# EAGLE design smartThermometer (EAGLE 7.2.0)
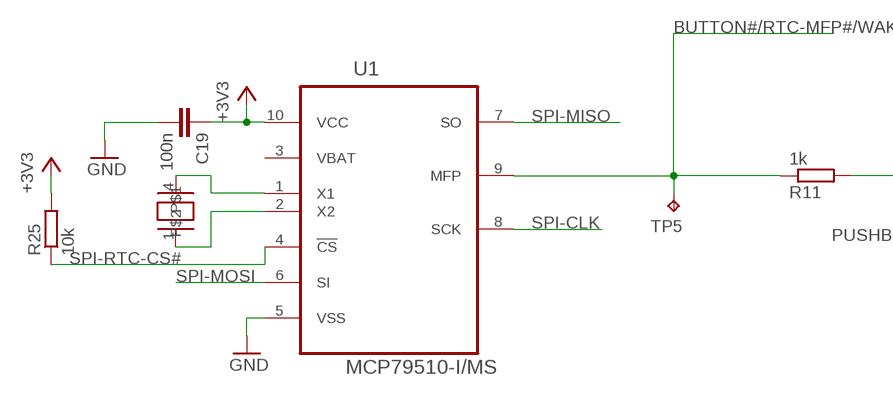
[diagram p0: schematic, sheet 1, part 1 of 2]
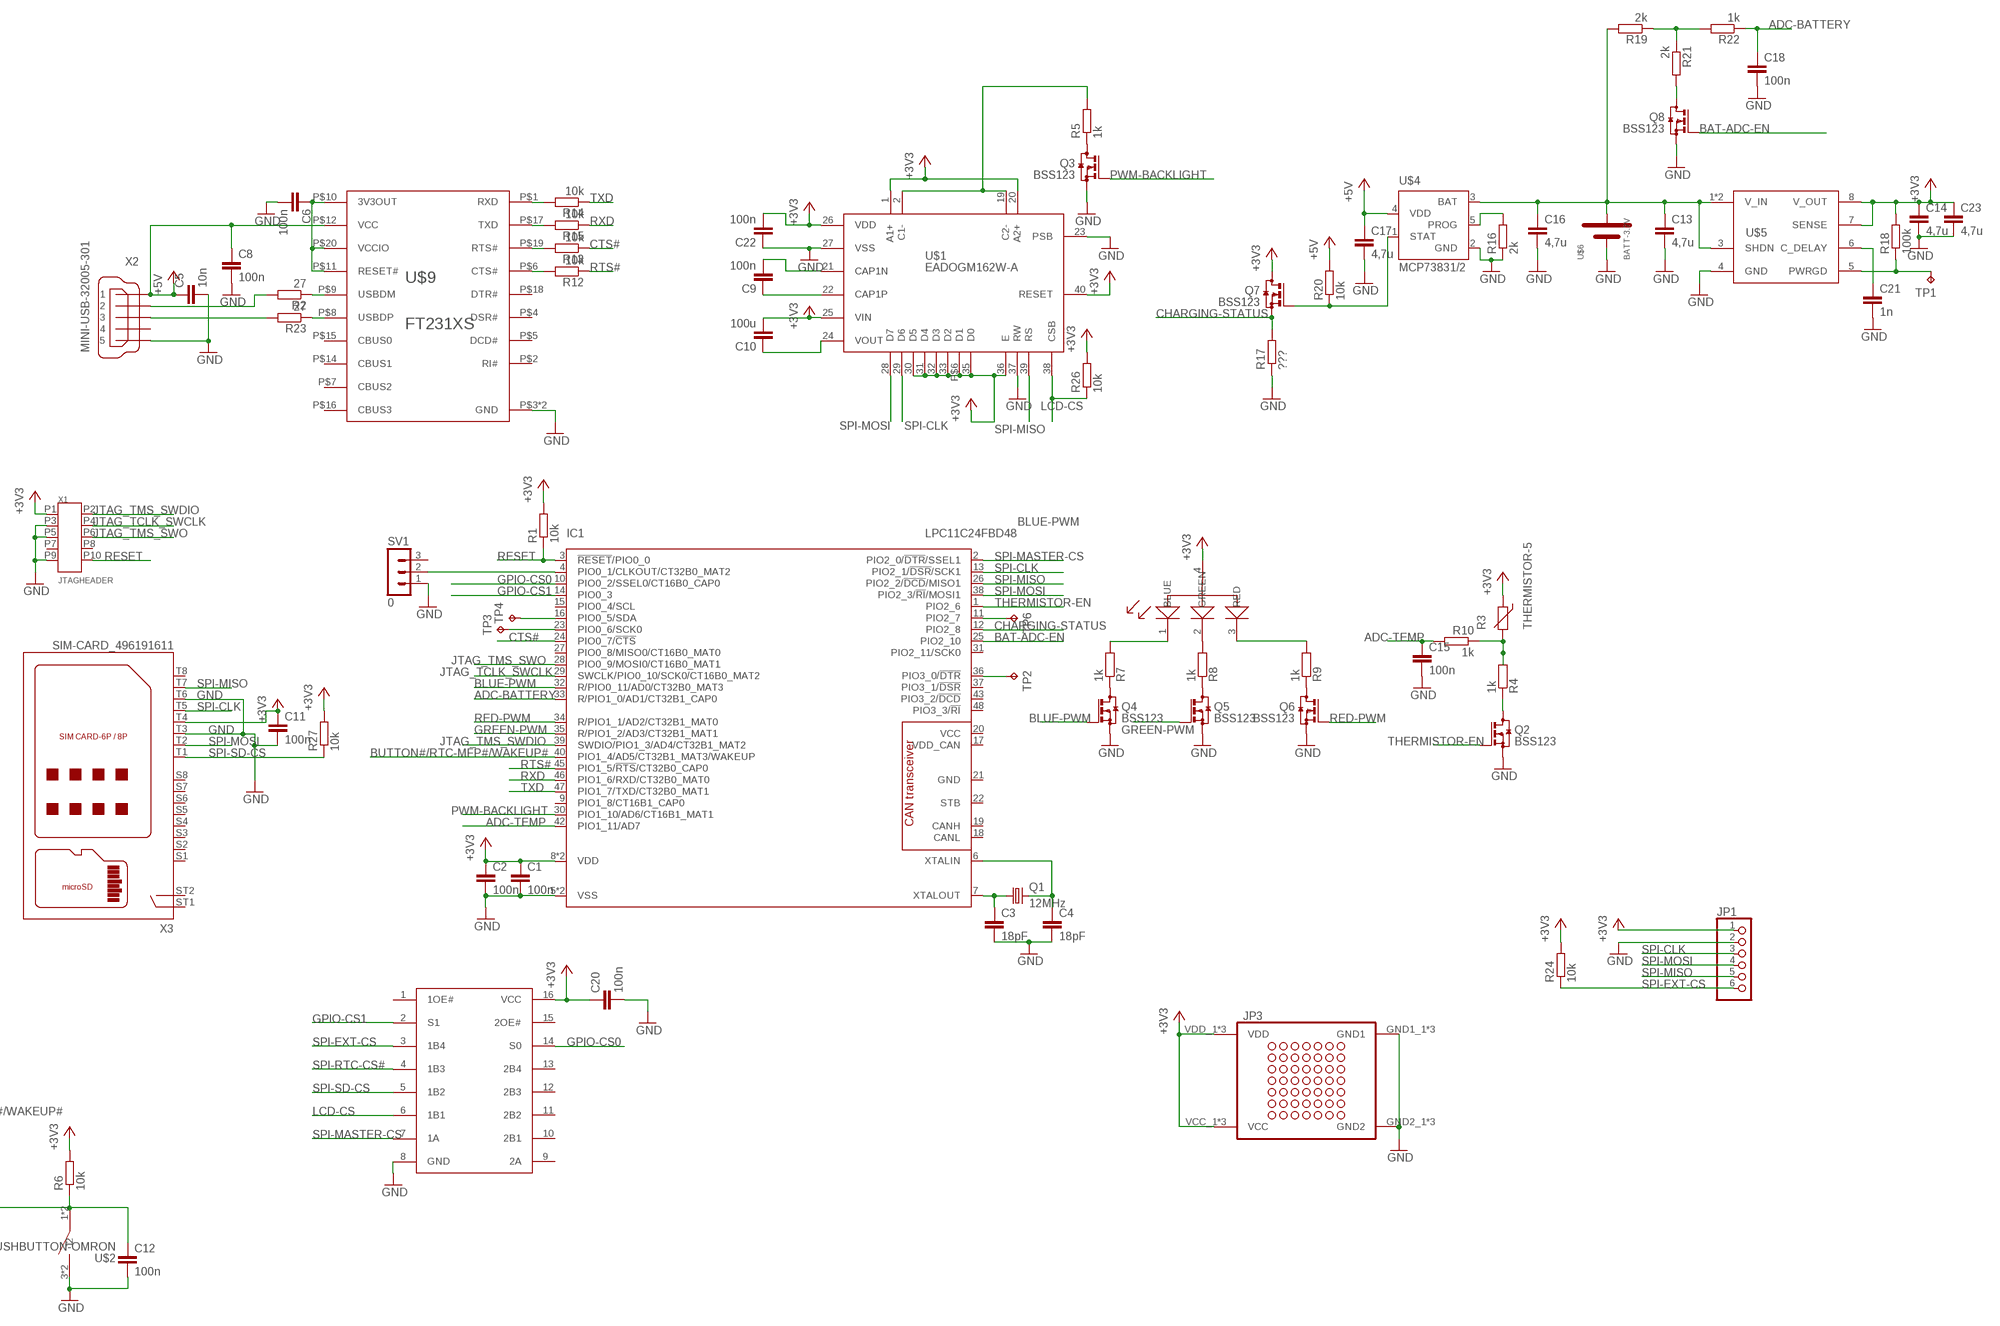
[diagram p1: schematic, sheet 1, part 2 of 2]

## Parts
C1  100n  C-EUC0603  [C0603]
C2  100n  C-EUC0603  [C0603]
C3  18pF  C-EUC0603  [C0603]
C4  18pF  C-EUC0603  [C0603]
C5  10n  C-EUC0603  [C0603]
C6  100n  C-EUC0603  [C0603]
C8  100n  C-EUC0603  [C0603]
C9  100n  C-EUC0603  [C0603]
C10  100u  C-EUC0603  [C0603]
C11  100n  C-EUC0603  [C0603]
C12  100n  C-EUC0603  [C0603]
C13  4,7u  C-EUC0805  [C0805]
C14  4,7u  C-EUC0805  [C0805]
C15  100n  C-EUC0603  [C0603]
C16  4,7u  C-EUC0805  [C0805]
C17  4,7u  C-EUC0805  [C0805]
C18  100n  C-EUC0603  [C0603]
C19  100n  C-EUC0603  [C0603]
C20  100n  C-EUC0603  [C0603]
C21  1n  C-EUC0603  [C0603]
C22  100n  C-EUC0603  [C0603]
C23  4,7u  C-EUC0805  [C0805]
IC1  LPC11C24FBD48  [SOT313-2]
JP1  PINHD-1X6  [1X06]
JP3  PROTOTYPE_2U_SMALL  [PROTOTYPE8X6]
Q1  12MHz  CRYSTALHC49UP  [HC49UP]
Q2  BSS123  [SOT23]
Q3  BSS123  [SOT23]
Q4  BSS123  [SOT23]
Q5  BSS123  [SOT23]
Q6  BSS123  [SOT23]
Q7  BSS123  [SOT23]
Q8  BSS123  [SOT23]
R1  10k  R-EU_R0603  [R0603]
R2  27  R-EU_R0603  [R0603]
R3  THERMISTOR-5  [R-5]
R4  1k  R-EU_R0603  [R0603]
R5  1k  R-EU_R0603  [R0603]
R6  10k  R-EU_R0603  [R0603]
R7  1k  R-EU_R0603  [R0603]
R8  1k  R-EU_R0603  [R0603]
R9  1k  R-EU_R0603  [R0603]
R10  1k  R-EU_R0603  [R0603]
R11  1k  R-EU_R0603  [R0603]
R12  10k  R-EU_R0603  [R0603]
R13  10k  R-EU_R0603  [R0603]
R14  10k  R-EU_R0603  [R0603]
R15  10k  R-EU_R0603  [R0603]
R16  2k  R-EU_R0603  [R0603]
R17  ???  R-EU_R0603  [R0603]
R18  100k  R-EU_R0603  [R0603]
R19  2k  R-EU_R0603  [R0603]
R20  10k  R-EU_R0603  [R0603]
R21  2k  R-EU_R0603  [R0603]
R22  1k  R-EU_R0603  [R0603]
R23  27  R-EU_R0603  [R0603]
R24  10k  R-EU_R0603  [R0603]
R25  10k  R-EU_R0603  [R0603]
R26  10k  R-EU_R0603  [R0603]
R27  10k  R-EU_R0603  [R0603]
SV1  0  MA03-1  [MA03-1]
TP1  TPTP18SQ  [TP18SQ]
TP2  TPTP16SQ  [TP16SQ]
TP3  TPTP16SQ  [TP16SQ]
TP4  TPTP16SQ  [TP16SQ]
TP5  TPTP16SQ  [TP16SQ]
TP6  TPTP16SQ  [TP16SQ]
U1  MCP79510-I/MS  [SOP50P490X110-10N]
U$1  EADOGM162W-A  [LCD_FOOTPRINT]
U$2  PUSHBUTTON-OMRON  [PUSHBUTTON-OMRON-B3FS-4002P]
U$3  LED-RGB-EVERLIGHT  [LED-RGB-EVERLIGHT]
U$4  MCP73831/2  [SOT23-5L]
U$5  MCP1725  [SO08]
U$6  BATT-3.7V  [MA02-1+-]
U$7  CRYSTAL-32.768KHZ-GEYER  [32.768KHZ]
U$8  DEMUX-1-4-NXP  [TSSOP16]
U$9  FT231XS  [SSOP20]
X1  JTAGHEADER  [HEADER10]
X2  MINI-USB-32005-301  [32005-301]
X3  SIM-CARD_496191611  [SIM-CARD_496191611]

## Nets
+3V3: C1.1 C2.1 C10.2 C11.1 C14.1 C19.1 C20.1 C22.2 C23.1 IC1.8(VDD) IC1.44(VDD) JP1.1 JP3.VCC_1(VCC) JP3.VCC_2(VCC) JP3.VCC_3(VCC) JP3.VDD_1(VDD) JP3.VDD_2(VDD) JP3.VDD_3(VDD) Q7.3(D) R1.2 R3.1 R6.2 R18.2 R24.2 R25.2 R26.2 R27.2 U1.10(VCC) U$1.1(A1+) U$1.20(A2+) U$1.25(VIN) U$1.26(VDD) U$1.30(D5) U$1.31(D4) U$1.32(D3) U$1.33(D2) U$1.35(D0) U$1.36(E) U$1.40(RESET) U$1.P$6(D1) U$3.4(COMMON_ANODE) U$5.7(SENSE) U$5.8(V_OUT) U$8.16(VCC) X1.P1 X3.T4
+5V: C5.1 C8.1 C17.1 R20.2 U$4.4(VDD) U$9.P$12(VCC) X2.1
ADC: R3.2 R4.2 R10.1
ADC-BATTERY: C18.1 IC1.33(R/PIO1_0/AD1/CT32B1_CAP0) R22.1
ADC-TEMP: C15.1 IC1.42(PIO1_11/AD7) R10.2
BAT-ADC-EN: IC1.25(PIO2_10) Q8.1(G)
BLUE-PWM: IC1.32(R/PIO0_11/AD0/CT32B0_MAT3) Q4.1(G)
BUTTON#/RTC-MFP#/WAKEUP#: IC1.40(PIO1_4/AD5/CT32B1_MAT3/WAKEUP) R11.1 TP5.TP U1.9(MFP)
CHARGING-STATUS: IC1.12(PIO2_8) Q7.2(S) R17.2
CTS#: IC1.24(PIO0_7/!CTS!) R13.1
GND: C1.2 C2.2 C3.2 C4.2 C5.2 C6.2 C8.2 C11.2 C12.2 C13.2 C14.2 C15.2 C16.2 C17.2 C18.2 C19.2 C20.2 C21.2 C22.1 C23.2 IC1.5(VSS) IC1.41(VSS) JP1.2 JP3.GND1_1(GND1) JP3.GND1_2(GND1) JP3.GND1_3(GND1) JP3.GND2_1(GND2) JP3.GND2_2(GND2) JP3.GND2_3(GND2) Q2.2(S) Q3.2(S) Q4.2(S) Q5.2(S) Q6.2(S) Q8.2(S) R16.1 R17.1 SV1.1 U1.5(VSS) U$1.23(PSB) U$1.27(VSS) U$1.37(RW) U$2.3 U$2.4 U$4.2(GND) U$5.4(GND) U$6.2(BAT-) U$8.8(GND) U$9.P$3(GND) U$9.P$13(GND) X1.P3 X1.P5 X1.P9 X2.5 X3.T3 X3.T6
GPIO-CS0: IC1.10(PIO0_2/SSEL0/CT16B0_CAP0) U$8.14(S0)
GPIO-CS1: IC1.14(PIO0_3) U$8.2(S1)
GREEN-PWM: IC1.35(R/PIO1_2/AD3/CT32B1_MAT1) Q5.1(G)
JTAG_TCLK_SWCLK: IC1.29(SWCLK/PIO0_10/SCK0/CT16B0_MAT2) X1.P4
JTAG_TMS_SWDIO: IC1.39(SWDIO/PIO1_3/AD4/CT32B1_MAT2) X1.P2
JTAG_TMS_SWO: IC1.28(PIO0_9/MOSI0/CT16B0_MAT1) X1.P6
LCD-CS: R26.1 U$1.38(CSB) U$8.6(1B1)
N$1: R2.2 X2.2
N$2: R23.2 X2.3
N$3: C3.1 IC1.7(XTALOUT) Q1.1
N$4: C4.1 IC1.6(XTALIN) Q1.2
N$5: C9.2 U$1.21(CAP1N)
N$6: C6.1 U$9.P$10(3V3OUT) U$9.P$11(RESET#) U$9.P$20(VCCIO)
N$7: C9.1 U$1.22(CAP1P)
N$8: C10.1 U$1.24(VOUT)
N$9: Q2.3(D) R4.1
N$10: R5.2 U$1.2(C1-) U$1.19(C2-)
N$11: Q3.3(D) R5.1
N$12: R2.1 U$9.P$9(USBDM)
N$13: R8.2 U$3.2(GREEN)
N$14: R7.2 U$3.1(BLUE)
N$15: R9.2 U$3.3(RED)
N$16: Q4.3(D) R7.1
N$17: Q5.3(D) R8.1
N$18: Q6.3(D) R9.1
N$19: IC1.4(PIO0_1/CLKOUT/CT32B0_MAT2) SV1.2
N$20: C13.1 C16.1 R19.2 U$4.3(BAT) U$5.1(V_IN) U$5.2(V_IN) U$5.3(SHDN) U$6.1(BAT+)
N$21: R16.2 U$4.5(PROG)
N$22: R19.1 R21.1 R22.2
N$23: Q7.1(G) R20.1 U$4.1(STAT)
N$24: R14.2 U$9.P$1(RXD)
N$25: R15.2 U$9.P$17(TXD)
N$26: C21.1 U$5.6(C_DELAY)
N$27: R18.1 TP1.TP U$5.5(PWRGD)
N$28: R13.2 U$9.P$19(RTS#)
N$29: R12.2 U$9.P$6(CTS#)
N$30: U1.1(X1) U$7.4
N$31: U1.2(X2) U$7.1
N$32: Q8.3(D) R21.2
N$33: R23.1 U$9.P$8(USBDP)
N$34: IC1.36(PIO3_0/!DTR!) TP2.TP
N$35: IC1.23(PIO0_6/SCK0) TP3.TP
N$36: IC1.16(PIO0_5/SDA) TP4.TP
N$37: IC1.11(PIO2_7) TP6.TP
N$38: C12.1 R6.1 R11.2 U$2.1 U$2.2
PWM-BACKLIGHT: IC1.30(PIO1_10/AD6/CT16B1_MAT1) Q3.1(G)
RED-PWM: IC1.34(R/PIO1_1/AD2/CT32B1_MAT0) Q6.1(G)
RESET: IC1.3(!RESET!/PIO0_0) R1.1 X1.P10
RTS#: IC1.45(PIO1_5/!RTS!/CT32B0_CAP0) R12.1
RXD: IC1.46(PIO1_6/RXD/CT32B0_MAT0) R15.1
SPI-CLK: IC1.13(PIO2_1/!DSR!/SCK1) JP1.3 U1.8(SCK) U$1.29(D6) X3.T5
SPI-EXT-CS: JP1.6 R24.1 U$8.3(1B4)
SPI-MASTER-CS: IC1.2(PIO2_0/!DTR!/SSEL1) U$8.7(1A)
SPI-MISO: IC1.26(PIO2_2/!DCD!/MISO1) JP1.5 U1.7(SO) U$1.39(RS) X3.T7
SPI-MOSI: IC1.38(PIO2_3/!RI!/MOSI1) JP1.4 U1.6(SI) U$1.28(D7) X3.T2
SPI-RTC-CS#: R25.1 U1.4(!CS) U$8.4(1B3)
SPI-SD-CS: R27.1 U$8.5(1B2) X3.T1
THERMISTOR-EN: IC1.1(PIO2_6) Q2.1(G)
TXD: IC1.47(PIO1_7/TXD/CT32B0_MAT1) R14.1
Unconnected: IC1.9(PIO1_8/CT16B1_CAP0) IC1.15(PIO0_4/SCL) IC1.17(VDD_CAN) IC1.18(CANL) IC1.19(CANH) IC1.20(VCC) IC1.22(STB) IC1.27(PIO0_8/MISO0/CT16B0_MAT0) IC1.31(PIO2_11/SCK0) IC1.37(PIO3_1/!DSR!) IC1.43(PIO3_2/!DCD!) IC1.48(PIO3_3/!RI!) SV1.3 U1.3(VBAT) U$8.1(1OE#) U$8.9(2A) U$8.10(2B1) U$8.11(2B2) U$8.12(2B3) U$8.13(2B4) U$8.15(2OE#) U$9.P$2(RI#) U$9.P$4(DSR#) U$9.P$5(DCD#) U$9.P$7(CBUS2) U$9.P$14(CBUS1) U$9.P$15(CBUS0) U$9.P$16(CBUS3) U$9.P$18(DTR#) X1.P7 X1.P8 X2.4 X3.S1 X3.S2 X3.S3 X3.S4 X3.S5 X3.S6 X3.S7 X3.S8 X3.ST1 X3.ST2 X3.T8

## Power pins joined to a net without a drawn wire
GND: IC1.21(GND)

## Library data of the parts
C1-C6 C8-C23 = rcl:C-EU: CAPACITOR, European symbol
IC1 = E7020E:LPC11C24FBD48
JP1 = pinhead:PINHD-1X6: PIN HEADER
JP3 = prototyping_small:PROTOTYPE_2U_SMALL: PIN HEADER
Q1 = crystal:CRYSTAL: CRYSTAL; OC_FARNELL: unknown; OC_NEWARK: unknown
Q2-Q8 = transistor-small-signal:BSS123: N-CHANNEL MOS FET
R1 R2 R4-R27 = rcl:R-EU_: RESISTOR, European symbol
R3 = varistor:THERMISTOR: THERMISTOR
SV1 = con-lstb:MA03-1: PIN HEADER; OC_FARNELL: unknown; OC_NEWARK: unknown
TP1-TP6 = testpad:TP: Test pad
U1 = Microchip-MCP795xx:MCP795: RTC, SPI, 2K EEPROM, 64B SRAM, 10MSOP; MPN: MCP79510-I/MS; OC_FARNELL: 2361124; OC_NEWARK: 47T5346; PACKAGE: 10MSOP; SUPPLIER: MICROCHIP
U$1 = user:EADOGM162W-A
U$2 = user:PUSHBUTTON-OMRON
U$3 = user:LED-RGB-EVERLIGHT
U$4 = maxim:MCP73831/2
U$5 = user:MCP1725
U$6 = user:BATT-3.7V
U$7 = Geyer:CRYSTAL-32.768KHZ-GEYER
U$8 = user:DEMUX-1-4-NXP
U$9 = user:FT231XS
X1 = E7020E:JTAGHEADER
X2 = con-cypressindustries:MINI-USB-: MINI USB-B Conector Source: www.cypressindustries.com; OC_FARNELL: unknown; OC_NEWARK: unknown
X3 = con-molex:SIM-CARD_496191611: MICROSD/SIM COMBO SOCKET RIGHT ENTRY TYPE Source: 1648045.pdf

## Board
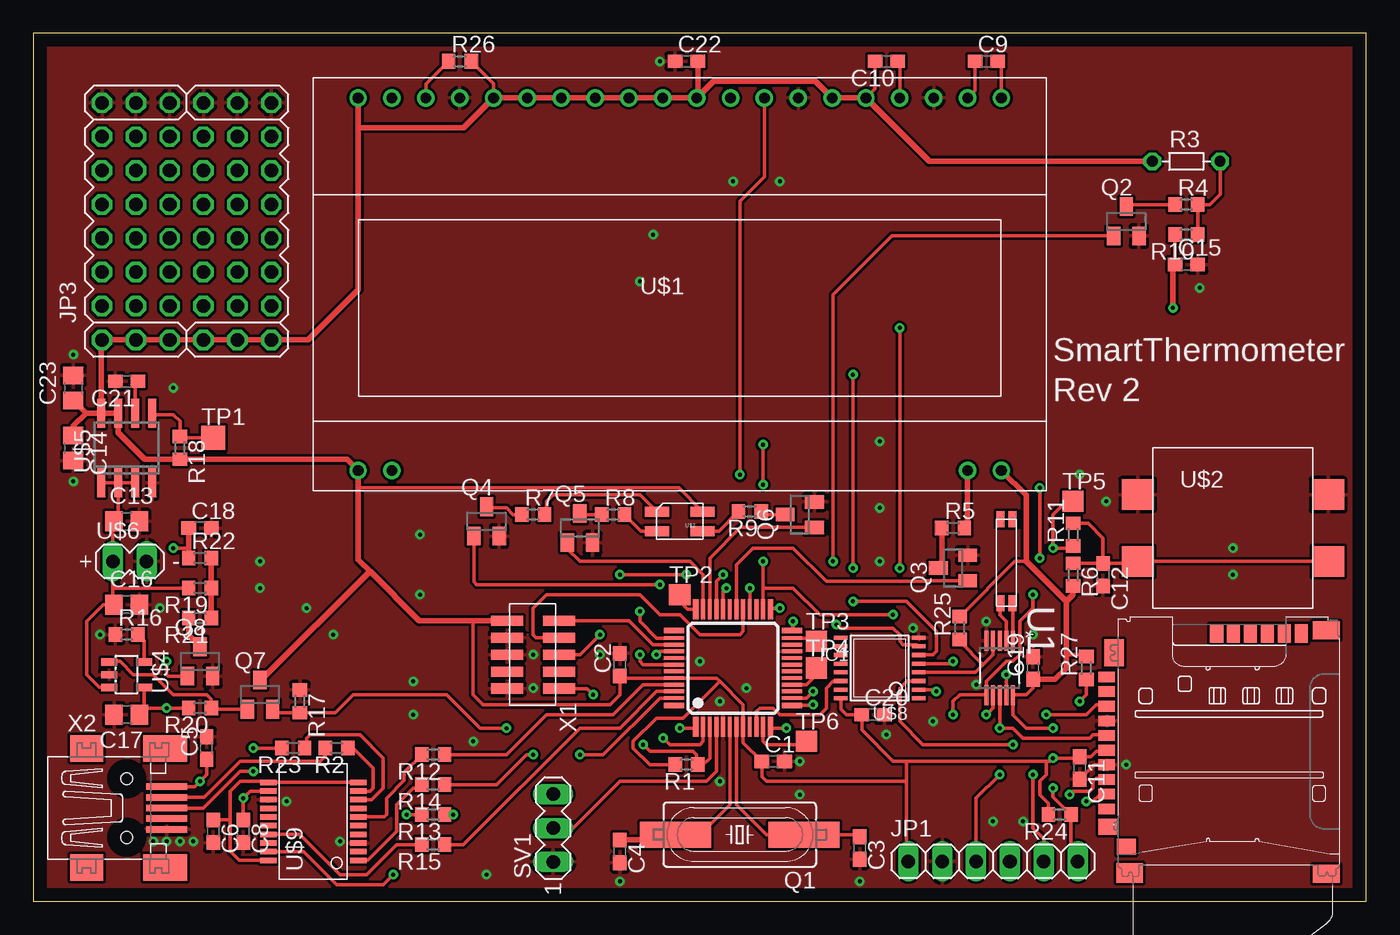
[diagram p2: board, top side]
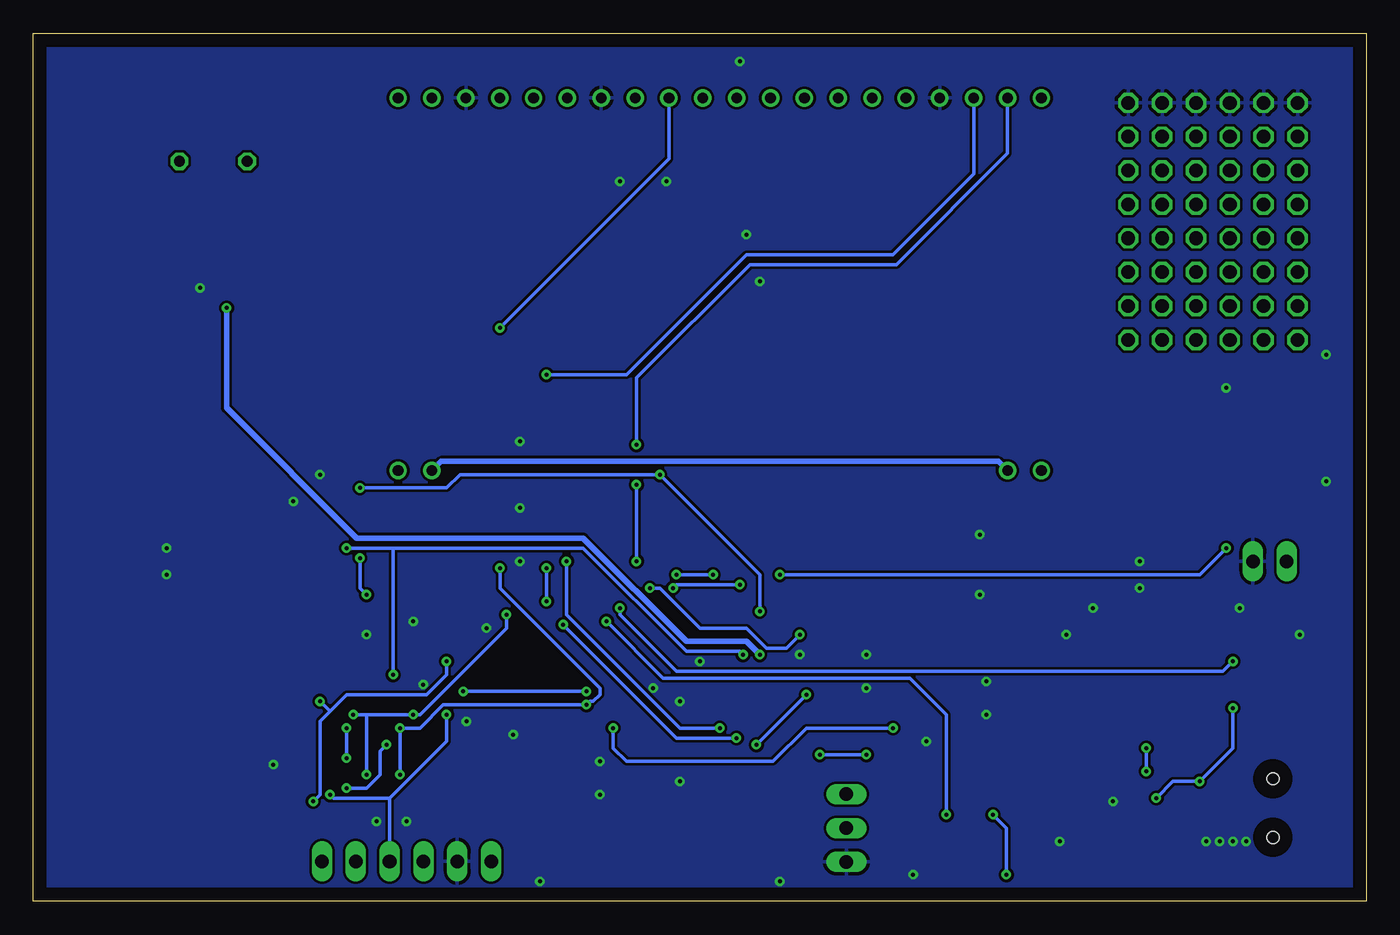
[diagram p3: board, bottom side, seen from below]

Size 100 x 65.1 mm. Coordinates in mm from the lower left corner, seen from the top.
Outline: 0,0 100,0 100,65.1 0,65.1 0,0
Copper layers (1*16): Top 0.035mm / dielectric 1.5mm / Bottom 0.035mm
Design rules "default *": minimum track width 0.2mm, minimum drill 0.3mm, track to track 0.2mm, track to pad 0.2mm, pad to pad 0.2mm, via to via 0.2mm, smd to smd 0mil, copper to edge 40mil, drill to drill 8mil, minimum pad ring 10mil, minimum via ring 8mil, stop-mask expansion 4mil, vias tented up to drill 0mil, thermal gap 10mil

### Footprints (pad centres in the part's own frame; a part is rotated, then mirrored left to right if it is on the bottom)
C0603 = smd 1.1 x 1: 1 -0.85,0; 2 0.85,0
C0805 = smd 1.3 x 1.5: 1 -0.95,0; 2 0.95,0
SOT313-2 = smd 0.4 x 1.5: 1 -2.81,-4.425; 12 2.81,-4.425; 25 2.81,4.425; 36 -2.81,4.425 | smd 0.28 x 1.5: 2 -2.25,-4.425; 3 -1.75,-4.425; 4 -1.25,-4.425; 5 -0.75,-4.425; 6 -0.25,-4.425; 7 0.25,-4.425; 8 0.75,-4.425; 9 1.25,-4.425; 10 1.75,-4.425; 11 2.25,-4.425; 26 2.25,4.425; 27 1.75,4.425; 28 1.25,4.425; 29 0.75,4.425; 30 0.25,4.425; 31 -0.25,4.425; 32 -0.75,4.425; 33 -1.25,4.425; 34 -1.75,4.425; 35 -2.25,4.425 | smd 1.5 x 0.4: 13 4.425,-2.81; 24 4.425,2.81; 37 -4.425,2.81; 48 -4.425,-2.81 | smd 1.5 x 0.28: 14 4.425,-2.25; 15 4.425,-1.75; 16 4.425,-1.25; 17 4.425,-0.75; 18 4.425,-0.25; 19 4.425,0.25; 20 4.425,0.75; 21 4.425,1.25; 22 4.425,1.75; 23 4.425,2.25; 38 -4.425,2.25; 39 -4.425,1.75; 40 -4.425,1.25; 41 -4.425,0.75; 42 -4.425,0.25; 43 -4.425,-0.25; 44 -4.425,-0.75; 45 -4.425,-1.25; 46 -4.425,-1.75; 47 -4.425,-2.25
1X06 = drill 1.016 long: 1 -6.35,0; 2 -3.81,0; 3 -1.27,0; 4 1.27,0; 5 3.81,0; 6 6.35,0
PROTOTYPE8X6 = drill 1.016 octagon: 1 -6.35,-6.35; 2 -3.81,-6.35; 3 -1.27,-6.35; 4 1.27,-6.35; 5 3.81,-6.35; 6 6.35,-6.35; 7 -6.35,-3.81; 8 -3.81,-3.81; 9 -1.27,-3.81; 10 1.27,-3.81; 11 3.81,-3.81; 12 6.35,-3.81; 13 -6.35,-1.27; 14 -3.81,-1.27; 15 -1.27,-1.27; 16 1.27,-1.27; 17 3.81,-1.27; 18 6.35,-1.27; 19 -6.35,1.27; 20 -3.81,1.27; 21 -1.27,1.27; 22 1.27,1.27; 23 3.81,1.27; 24 6.35,1.27; 25 -6.35,3.81; 26 -3.81,3.81; 27 -1.27,3.81; 28 1.27,3.81; 29 3.81,3.81; 30 6.35,3.81; 31 -6.35,6.35; 32 -3.81,6.35; 33 -1.27,6.35; 34 1.27,6.35; 35 3.81,6.35; 36 6.35,6.35; GND1_1 8.89,6.35; GND1_2 8.89,3.81; GND1_3 8.89,1.27; GND2_1 8.89,-1.27; GND2_2 8.89,-3.81; GND2_3 8.89,-6.35; VCC_1 -8.89,-1.27; VCC_2 -8.89,-3.81; VCC_3 -8.89,-6.35; VDD_1 -8.89,6.35; VDD_2 -8.89,3.81; VDD_3 -8.89,1.27
HC49UP = smd 5.334 x 1.93: 1 -4.826,0; 2 4.826,0
SOT23 = smd 1 x 1.4: 1 -0.95,-1.1; 2 0.95,-1.1; 3 0,1.1
R0603 = smd 1 x 1.1: 1 -0.85,0; 2 0.85,0
R-5 = drill 0.813 octagon: 1 -2.54,0; 2 2.54,0
MA03-1 = drill 1.016 long: 1 -2.54,0; 2 0,0; 3 2.54,0
TP18SQ = smd 1.8 x 1.8: TP 0,0
TP16SQ = smd 1.6 x 1.6: TP 0,0
SOP50P490X110-10N = smd 1.499 x 0.3: 1 -2.057,1; 2 -2.057,0.5; 3 -2.057,0; 4 -2.057,-0.5; 5 -2.057,-1; 6 2.057,-1; 7 2.057,-0.5; 8 2.057,0; 9 2.057,0.5; 10 2.057,1
LCD_FOOTPRINT = drill 0.8: 1 -24.13,-12.19; 2 -21.59,-12.19; 19 21.59,-12.19; 20 24.13,-12.19; 21 24.13,15.75; 22 21.59,15.75; 23 19.05,15.75; 24 16.51,15.75; 25 13.97,15.75; 26 11.43,15.75; 27 8.89,15.75; 28 6.35,15.75; 29 3.81,15.75; 30 1.27,15.75; 31 -1.27,15.75; 32 -3.81,15.75; 33 -6.35,15.75; 35 -8.89,15.75; 36 -13.97,15.75; 37 -16.51,15.75; 38 -19.05,15.75; 39 -21.59,15.75; 40 -24.13,15.75; P$6 -11.43,15.75
PUSHBUTTON-OMRON-B3FS-4002P = smd 2.4 x 2.3: 1 7.15,-2.5; 2 -7.15,-2.5; 3 7.15,2.5; 4 -7.15,2.5
LED-RGB-EVERLIGHT = smd 1.8 x 0.75: 1 1.7,-0.725; 2 1.7,0.725; 3 -1.7,0.725; 4 -1.7,-0.725
SOT23-5L = smd 0.55 x 1.2: 1 -0.95,-1.3; 2 0,-1.3; 3 0.95,-1.3; 4 0.95,1.3; 5 -0.95,1.3
SO08 = smd 0.6 x 2.2: 1 -1.905,-2.6; 2 -0.635,-2.6; 3 0.635,-2.6; 4 1.905,-2.6; 5 1.905,2.6; 6 0.635,2.6; 7 -0.635,2.6; 8 -1.905,2.6
MA02-1+- = drill 1.016 long: 1 -2.54,0; 2 0,0
32.768KHZ = smd 1.2 x 0.6: 1 -3.15,0.45; 2 3.15,0.45; 3 3.15,-0.45; 4 -3.15,-0.45
TSSOP16 = smd 0.305 x 0.991: 1 -2.275,-2.918; 2 -1.625,-2.918; 3 -0.975,-2.918; 4 -0.325,-2.918; 5 0.325,-2.918; 6 0.975,-2.918; 7 1.625,-2.918; 8 2.275,-2.918; 9 2.275,2.918; 10 1.625,2.918; 11 0.975,2.918; 12 0.325,2.918; 13 -0.325,2.918; 14 -0.975,2.918; 15 -1.625,2.918; 16 -2.275,2.918
SSOP20 = smd 0.42 x 1.25: P$1 -2.925,-3.375; P$2 -2.275,-3.375; P$3 -1.625,-3.375; P$4 -0.975,-3.375; P$5 -0.325,-3.375; P$6 0.325,-3.375; P$7 0.975,-3.375; P$8 1.625,-3.375; P$9 2.275,-3.375; P$10 2.925,-3.375; P$11 2.925,3.375; P$12 2.275,3.375; P$13 1.625,3.375; P$14 0.975,3.375; P$15 0.325,3.375; P$16 -0.325,3.375; P$17 -0.975,3.375; P$18 -1.625,3.375; P$19 -2.275,3.375; P$20 -2.925,3.375
HEADER10 = smd 0.76 x 2.4: P1 -2.54,-1.95; P2 -2.54,1.95; P3 -1.27,-1.95; P4 -1.27,1.95; P5 0,-1.95; P6 0,1.95; P7 1.27,-1.95; P8 1.27,1.95; P9 2.54,-1.95; P10 2.54,1.95
32005-301 = smd 3.1 x 0.5: 1 3,1.6; 2 3,0.8; 3 3,0; 4 3,-0.8; 5 3,-1.6 | smd 2.5 x 2: M1 -3,-4.45; M2 -3,4.45 | smd 3.3 x 2: M3 2.9,4.45; M4 2.9,-4.45 | hole 0.9: 0,2.2; 0,-2.2
SIM-CARD_496191611 = smd 2 x 1.35: G1 1,18.938; G2 1,0.675 | smd 2 x 1.45: G3 15.75,18.887 | smd 1.45 x 2: G4 16.925,2.35 | smd 1.25 x 0.8: S1 17.475,4.162; S5 17.475,14.062; T1 17.475,12.963; T2 17.475,11.863; T3 17.475,10.762; T4 17.475,9.662; T5 17.475,8.562; T6 17.475,7.463; T7 17.475,6.362; T8 17.475,5.263 | smd 0.98 x 1.4: S2 9.225,0.9; S3 6.685,0.9; S4 4.145,0.9; S6 7.955,0.9; S7 5.415,0.9; S8 2.875,0.9 | smd 1.4 x 1.2: ST1 17.4,15.412; ST2 16,16.913

### Placement (x,y rotation side)
C1  55.5,10.5 0 top
C2  44,17.75 90 top
C3  62,4 270 top
C4  44,3.75 270 top
C5  13,11.5 90 top
C6  13.5,5.25 270 top
C8  15.75,5.25 270 top
C9  71.5,63 0 top
C10  64,63 180 top
C11  78.5,10 270 top
C12  80.25,24.5 270 top
C13  7,28.5 0 top
C14  3,34 270 top
C15  86.5,47.75 0 top
C16  7,22.25 0 top
C17  7,14 180 top
C18  12.5,28 0 top
C19  75,17.5 90 top
C20  63,14 0 top
C21  7,39 180 top
C22  49,63 0 top
C23  3,38.5 90 top
IC1  52.5,17.5 0 top
JP1  72,3 0 top
JP3  11.5,51 90 top
Q1  53,5 180 top
Q2  82,51 0 top
Q3  69,25 90 top
Q4  34,28.5 0 top
Q5  41,28 0 top
Q6  57.5,29 90 top
Q7  17,15.5 0 top
Q8  12.5,18 0 top
R1  49,10.25 180 top
R2  22.75,11.5 180 top
R3  86.5,55.5 0 top
R4  86.5,52.25 0 top
R5  69,28 0 top
R6  78,24.5 270 top
R7  37.5,29 0 top
R8  43.5,29 0 top
R9  53.75,29.25 180 top
R10  86.5,50 180 top
R11  78,27.5 90 top
R12  30,11 180 top
R13  30,6.5 180 top
R14  30,8.75 180 top
R15  30,4.25 180 top
R16  7,20 0 top
R17  20,15 270 top
R18  11,34 270 top
R19  12.5,23.5 180 top
R20  12.5,14.5 180 top
R21  12.5,21.25 180 top
R22  12.5,25.75 0 top
R23  19.5,11.5 180 top
R24  77,6.5 180 top
R25  69.5,20.5 90 top
R26  32,63 0 top
R27  79,17.5 90 top
SV1  39,5.5 90 top
TP1  13.5,34.75 0 top
TP2  48.5,23 0 top
TP3  58.75,19.5 0 top
TP4  58.75,17.5 0 top
TP5  78,30 0 top
TP6  58,12 0 top
U1  72.5,17.5 270 top
U$1  48.5,44.5 0 top
U$2  90,28 0 top
U$3  48.5,28.5 180 top
U$4  7,17 270 top
U$5  7,34 0 top
U$6  8.5,25.5 0 top
U$7  73,25.5 90 top
U$8  63.5,17.5 90 top
U$9  21,6 90 top
X1  37.5,18.5 270 top
X2  7,7 0 top
X3  98,21 180 top

### Tracks (layer width: path | path; a pad name or v marks a point on that pad's centre or on a via)
+3V3  (via drill 0.3 pad 0.25)
  Top 0.254: C20.1 61.81,14 | 51.5,16.5 51.25,16.75 IC1.44 44.15,16.75 C2.1 44,15.5 43.25,14.75 33.75,14.75 33,15.5 33,21.04 | 51.5,16.5 53.25,14.75 IC1.8 53.25,11.9 C1.1 54.65,9.35 55,9 65.5,9 | 51.5,16.5 48.75,13.75 46.75,13.75 45,12 45,11.5 46.25,10.25 R1.2 | U$8.16 60.58,14.42 61,14 C20.1 | C19.1 75,16 74.5,15.5 73.56,15.5 U1.10 73.5,14 74.5,13 v76.5,13 | C20.1 62.15,12.85 64.5,10.5 65.5,10.5 | 65.5,10.5 76,10.5 | 76,10.5 76.25,10.5 v76.5,10.75 78.4,10.75 C11.1 79.35,10.85 79.75,11.25 80.44,11.25 X3.T4 | 63,62.85 C10.2 63.15,60.93 U$1.25 | JP1.1 65.5,3.15 65.5,9 | 65.5,9 65.5,10.5 | JP3.VDD_1 5.09,42.05 | R24.2 76.15,7.35 75.5,8 75.5,9 76,9.5 76,10.5 | R25.2 73.65,25.5 74.5,25.5 | R27.2 78.85,18.5 77.5,18.5 | 49.77,62.92 C22.2 | U$1.36 34.53,61.32 R26.2 | U$3.4 48.42,31 24.37,31
  Top 0.406: X1.P1 33,21.04 28.96,21.04 25.25,24.75 | Q7.3 17.1,16.6 25.25,24.75 | C19.1 76.65,16.65 77.5,17.5 77.5,18.5 77.5,22.5 | 3.45,37.55 C23.1 3.95,36.6 | 25.25,24.75 24.37,25.63 24.37,31 U$1.1 23.53,33.15 R18.2 8.35,33.15 6.37,35.13 U$5.7 U$5.8 | U$5.8 3.95,36.6 | 3.95,36.6 3,35.65 C14.1 | 5.09,42.05 U$5.8 | JP3.VDD_1 JP3.VDD_2 JP3.VDD_3 JP3.VCC_1 JP3.VCC_2 JP3.VCC_3 20.61,42.11 24.37,45.87 24.37,58 | U$1.40 24.37,58 | 49.85,60.33 U$1.30 U$1.31 U$1.32 U$1.33 U$1.35 U$1.P$6 U$1.36 32.28,58 24.37,58 | 49.85,60.33 C22.2 | 49.85,60.33 51.02,61.5 58.68,61.5 U$1.26 U$1.25 67.22,55.5 R3.1 | U$1.20 74.5,30.44 74.5,25.5 77.5,22.5 | 77.5,22.5 78,23 R6.2
  Bottom 0.254: v76.5,13 v76.5,10.75
+5V  (via drill 0.3)
  Top 0.254: U$4.4 8.3,14.35 C17.1 8.45,14.5 v10,14.5 R20.2 | U$9.P$12 16.27,8.28 v15.75,7.75 C8.1 | X2.1 12.1,8.6 v12.5,9 13,9.5 C5.1
  Bottom 0.254: v15.75,7.75 14.5,9 v12.5,9 10,11.5 v10,14.5
ADC
  Top 0.254: R10.1 R4.2 88.25,52.25 89.04,53.04 R3.2
ADC-BATTERY  (via drill 0.3 pad 0.25)
  Top 0.254: IC1.33 51.25,24 v51.75,24.5 | v49,24.5 v44,24.5 | v10.5,26.5 11.65,26.5
  Top 0.406: C18.1 11.65,26.5 R22.1
  Bottom 0.254: v44,24.5 12.5,24.5 v10.5,26.5 | v49,24.5 v51.75,24.5
ADC-TEMP  (via drill 0.3, 0.3 pad 0.25)
  Top 0.254: R10.2 C15.1 | IC1.42 45.75,17.75 45.5,18 v45.5,18.5
  Top 0.406: C15.1 85.5,47.6 v85.5,44.5
  Bottom 0.406: v45.5,18.5 46.5,19.5 51,19.5 58.75,27.25 75.75,27.25 85.5,37 v85.5,44.5
BAT-ADC-EN  (via drill 0.3 pad 0.25)
  Top 0.254: Q8.1 10.1,16.9 10,17 v10,18 | v56,22 55.38,22 IC1.25
  Bottom 0.254: v56,22 56,21.5 51.75,17.25 10.75,17.25 v10,18
BLUE-PWM  (via drill 0.3, 0.3 pad 0.25)
  Top 0.254: Q4.1 33.05,23.95 33.25,23.75 v47,23.75 | IC1.32 51.75,23.25 v52,23.5
  Bottom 0.254: v52,23.5 51.75,23.75 v47,23.75
BUTTON#/RTC-MFP#/WAKEUP#  (via drill 0.3)
  Top 0.254: IC1.40 47,18.75 v46.75,18.5 | R11.1 77.35,26.5 v76.5,26.5 76.5,29 77.5,30 TP5.TP | U1.9 v73,17
  Bottom 0.254: v46.75,18.5 47,18.75 51,18.75 58.75,26.5 73,26.5 | v76.5,26.5 73,26.5 | v73,17 73,26.5
CHARGING-STATUS  (via drill 0.3 pad 0.25)
  Top 0.254: Q7.2 18.2,14.15 R17.2 22.65,14.15 24,15.5 31,15.5 33.5,13 v35.5,13 | v56.5,13 55.38,13 IC1.12
  Bottom 0.254: v35.5,13 42,13 44.5,10.5 55.5,10.5 56.5,11.5 v56.5,13
CTS#  (via drill 0.3 pad 0.25)
  Top 0.254: v57,21 57,20.39 IC1.24 | v31.5,6.5 R13.1
  Bottom 0.254: v31.5,6.5 31.5,14 34.25,16.75 52.75,16.75 v57,21
GND  (via drill 0.3, 0.3 pad 0.25)
  Top 0.254: C11.2 79.59,10.24 X3.T3
  other vias: 66,20.5 64,12.5 51.5,9 57.5,10.5 42.5,18.5 5,20 47,63 51.5,15 50,18 53.5,16 17,25.5 17,23.5 10.5,38.5 12,4.5 34,2 33,12 28.5,14 19,7.5 23,4.5 28.5,16.5 20.5,22 22.5,20 29,23 90,24.5 90,26.5 75,20 37.5,18.5 37.5,16 82,10.25 71.5,21 11,4.5 10,4.5 9,4.5 9.5,22 3,41 3,31.5 74.25,6 72,6 62,1.5 44,1.5 57.5,8 70.75,16.25 67.5,13.5 63.5,25.5 87.5,46 63.5,29.5 63.5,34.5 45.5,46.5 46.5,50 52.5,54 56,54 78.5,32 80.5,30 29,27.5
  pour Top: -0.5,72.5 101,72.5 101,-1.5 -0.5,-1.5
  pour Bottom: -0.5,73 101,73 101,-1.5 -0.5,-1.5
GPIO-CS0
  Top 0.254: IC1.10 54.25,14.25 54.5,14.5 55.5,14.5 56,14 59,14 59.5,14.5 59.5,16 60,16.5 60.56,16.5 U$8.14
GPIO-CS1  (via drill 0.3 pad 0.25)
  Top 0.254: IC1.14 58,15.25 v58.5,15.75 | U$8.2 67.62,15.88 v67.75,15.75
  Bottom 0.254: v58.5,15.75 v67.75,15.75
GREEN-PWM
  Top 0.254: Q5.1 40.05,26.45 41,25.5 49.25,25.5 50.25,24.5 IC1.35
JTAG_TCLK_SWCLK
  Top 0.254: X1.P4 37.73,19.77 37.5,20 37.5,22 38.5,23 45.5,23 47,21.5 48.5,21.5 50,20 53,20 53.25,20.25 IC1.29
JTAG_TMS_SWDIO
  Top 0.254: X1.P2 44.71,21.04 46.5,19.25 IC1.39
JTAG_TMS_SWO  (via drill 0.3, 0.3 pad 0.25)
  Top 0.254: X1.P6 41,18.5 v42.5,20 | v53.75,23.5 IC1.28
  Bottom 0.254: v53.75,23.5 53,23.5 50,20.5 46.5,20.5 45,19 43.5,19 v42.5,20
LCD-CS  (via drill 0.3, 0.3 pad 0.25)
  Top 0.254: U$8.6 67.47,18.48 67.75,18.75 67.75,20.25 65.5,22.5 v61.5,22.5 | R26.1 29.45,61.3 U$1.38 | v61.5,25 v61.5,39.5
  Bottom 0.254: v61.5,22.5 v61.5,25 | U$1.38 29.45,54.55 35.5,48.5 46.5,48.5 55.5,39.5 v61.5,39.5
N$1
  Top 0.254: X2.2 12.8,7.8 15.5,10.5 21.5,10.5 21.9,10.9 R2.2
N$2  (via drill 0.3)
  Top 0.254: X2.3 12.75,7 15.5,9.75 v16.5,9.75 | v16.5,11.5 R23.2
  Bottom 0.254: v16.5,9.75 v16.5,11.5
N$3
  Top 0.254: IC1.7 52.75,7.25 55,5 Q1.1 61.85,5 C3.1
N$4
  Top 0.254: 48.29,4.7 Q1.2 50,5 52.25,7.25 IC1.6
  Top 0.406: C4.1 47.77,4.6 Q1.2
N$5
  Top 0.254: U$1.21 72.63,62.72 C9.2
N$6
  Top 0.254: U$9.P$10 U$9.P$11 17.55,9 15.5,9 14.75,8.25 14.75,6 | U$9.P$20 15.43,3.08 14.75,3.75 14.75,6 | C6.1 14.65,6.1 14.75,6
N$7
  Top 0.254: 70.5,62.85 C9.1 70.65,60.81 U$1.22
N$8
  Top 0.254: C10.1 65.01,62.84 U$1.24
N$9
  Top 0.254: R4.1 82.15,52.25 Q2.3
N$10
  Top 0.254: R5.2 70.2,28.2 70.09,28.31
  Top 0.406: 70.09,28.31 U$1.19
  Bottom 0.406: U$1.2 27.6,33 69.4,33 U$1.19
N$11
  Top 0.406: Q3.3 68.15,25.25 R5.1
N$12
  Top 0.254: R2.1 24,11.5 25.5,10 25.5,8.5 25.25,8.25 24.4,8.25 U$9.P$9
N$13
  Top 0.254: U$3.2 45.58,27.77 R8.2
N$14
  Top 0.254: R7.2 38.5,29.15 38.5,30 39,30.5 45.52,30.5 U$3.1
N$15
  Top 0.254: 52.88,29.23 R9.2 51.42,27.77 U$3.3
N$16
  Top 0.254: R7.1 36,29 35.5,29.5 34.1,29.5 Q4.3
N$17
  Top 0.254: R8.1 41.1,29 Q5.3
N$18
  Top 0.254: Q6.3 54.85,29 R9.1
N$19
  Top 0.254: IC1.4 51.25,9.75 50.5,9 44,9 40.5,5.5 SV1.2
N$20
  Top 0.254: 5.96,23.5 U$6.1 5.96,28.41 C13.1 6.37,28.82 U$5.2 | 5.96,23.5 5.96,22.09 C16.1 5.25,22.25 4,21 4,17 4.95,16.05 U$4.3 | R19.2 5.96,23.5 | U$5.3 U$5.2 | U$5.1 U$5.2
N$21
  Top 0.254: U$4.5 8.3,19.55 R16.2
N$22
  Top 0.406: R22.2 R19.1 R21.1
N$23
  Top 0.254: Q7.1 13.45,14.4 R20.1 13.35,15.15 13,15.5 10.5,15.5 9,17 7.5,17 6.5,18 5.75,18 U$4.1
N$24
  Top 0.254: U$9.P$1 25.07,3.08 27.25,5.25 27.25,7.25 28.5,8.5 28.9,8.5 R14.2
N$25
  Top 0.254: U$9.P$17 19.98,5.03 23,2 25,2 27.25,4.25 R15.2 29.25,4.15
N$26
  Top 0.254: U$5.6 7.63,38.78 C21.1
N$27
  Top 0.254: U$5.5 9.01,36.5 10.5,36.5 11,36 R18.1 11,34.75 TP1.TP
N$28  (via drill 0.3)
  Top 0.254: U$9.P$19 20.27,3.73 22.75,1.25 26.25,1.25 v27,2 | v28,6.5 R13.2
  Bottom 0.254: v27,2 27,5.5 v28,6.5
N$29
  Top 0.254: R12.2 27.82,9.68 27.82,9.07 26.5,7.75 26.5,6.5 26.32,6.33 U$9.P$6
N$30
  Top 0.254: U1.1 73.5,22 73.45,22 U$7.4
N$31
  Top 0.254: U1.2 73,21 72.5,21.5 72.5,22.3 U$7.1
N$32
  Top 0.406: R21.2 11.65,19.95 Q8.3
N$33
  Top 0.254: U$9.P$8 25.38,7.62 26.25,8.5 26.25,10.75 24.5,12.5 20.75,12.5 20.5,12.25 20.5,11.65 R23.1
N$34
  Top 0.254: IC1.36 49.08,21.93 48.5,22.5 TP2.TP
N$35
  Top 0.254: IC1.23 58.25,19.75 TP3.TP
N$36
  Top 0.254: IC1.16 58,16.25 58.5,16.75 58.5,17.25 TP4.TP
N$37
  Top 0.254: IC1.11 54.75,12 55,11.75 57.75,11.75 TP6.TP
N$38
  Top 0.254: C12.1 82.7,25.35 U$2.2 U$2.1 | C12.1 R6.1 | R11.2 79.15,28.35 80.25,27.25 C12.1
PWM-BACKLIGHT
  Top 0.254: Q3.1 67,24.05 | 67,24.05 66.95,24.05 | IC1.30 52.75,25.25 54,26.5 57,26.5 59.5,24 66.95,24 67,24.05
RED-PWM
  Top 0.254: IC1.34 50.75,25.75 53.05,28.05 Q6.1
RESET  (via drill 0.3)
  Top 0.254: IC1.3 50.75,10.75 50.25,10.25 R1.1 49.75,10.35 49.75,11 49.5,11.25 46.25,11.25 v45.75,11.75 | X1.P10 41.54,15.96 v42,15.5
  Bottom 0.254: v42,15.5 v45.75,11.75
RTS#
  Top 0.254: IC1.45 45.75,16.25 43.5,14 38.5,14 35.5,11 R12.1
RXD
  Top 0.254: IC1.46 46.75,15.75 44,13 41,13 32.25,4.25 R15.1
SPI-CLK  (via drill 0.3, 0.3 pad 0.25)
  Top 0.254: IC1.13 58.44,14.69 v58.5,14.75 | U1.8 v72.5,13 73.5,13 74.25,12.25 79.25,12.25 79.5,12.5 80.46,12.5 X3.T5 | JP1.3 70.73,7.73 v72.5,9.5 | v65,25 v65,43
  Bottom 0.254: v65,25 65,23.5 57.5,16 57.5,15.5 58,15 58.25,15 v58.5,14.75 69.25,14.75 71,13 v72.5,13 v72.5,9.5 | v65,43 52.31,55.69 U$1.29
SPI-EXT-CS  (via drill 0.3)
  Top 0.254: U$8.3 65.53,16.52 65,16 65,13.5 66.75,11.75 v73.5,11.75 | JP1.6 77.85,3.5 R24.1 76.5,7.85 v76.5,8.5
  Bottom 0.254: v73.5,11.75 74,11.25 74,9.5 75,8.5 v76.5,8.5
SPI-MASTER-CS  (via drill 0.3 pad 0.25)
  Top 0.254: IC1.2 50.25,12 50,11.75 47.75,11.75 v47.25,12.25 47.5,12 | U$8.7 66.29,19.25 65.25,19.25 65,19.5 65,20 64.5,20.5 60.5,20.5 v60.25,20.75
  Bottom 0.254: v47.25,12.25 51.75,12.25 v60.25,20.75
SPI-MISO  (via drill 0.3, 0.3 pad 0.25)
  Top 0.254: IC1.26 54.75,23.5 | 54.75,23.5 v54.75,25.5 | U1.7 72,14.5 v71.5,14 | v64.5,21.5 59,21.5 57,23.5 54.75,23.5 | v76,14 79,14 79.75,14.75 80.41,14.75 X3.T7 | JP1.5 75.81,4.69 75,5.5 v75,9.5 | v54.75,31.25 v54.75,34.25
  Bottom 0.254: 75,14 v71.5,14 71,14 64.5,20.5 v64.5,21.5 | 75,14 v76,14 | v75,9.5 75,14 | U$1.39 26.91,56.09 35.25,47.75 46.25,47.75 54.75,39.25 v54.75,34.25 | v54.75,31.25 v54.75,25.5
SPI-MOSI  (via drill 0.3, 0.3 pad 0.25)
  Top 0.254: 71.5,15 U1.6 71.44,15.5 | IC1.38 46.75,19.75 45.5,21 v45.5,21.75 | v69,14 69,15 69.5,15.5 71.44,15.5 | 71.44,15.5 71.5,15.5 71.5,16.5 73,18 73.5,18 74,18.5 74,21 75,22 v75,23 | X3.T2 80.41,9.25 79.75,9.25 79.5,9 79.5,8.5 79.25,8.25 78,8.25 v77.75,8 | U$1.28 54.85,54.35 53,52.5 v53,32 | v75.5,25.75 v75.5,31
  Bottom 0.254: v69,14 69,12 73.27,7.73 | 73.27,7.73 JP1.4 | 73.27,7.73 77.48,7.73 v77.75,8 | v75,23 75.5,23.5 v75.5,25.75 | v75.5,31 69,31 68,32 v53,32 45.5,24.5 v45.5,21.75
SPI-RTC-CS#
  Top 0.254: U$8.4 70.67,17.18 71.25,17.75 | 71.25,17.75 72,18.5 U1.4 | 71.25,17.75 69.5,19.5 R25.1
SPI-SD-CS  (via drill 0.3, 0.3 pad 0.25)
  Top 0.254: U$8.5 68.83,17.82 v69,18 | v79,7.5 79.5,7.5 80,8 80.49,8 X3.T1 | R27.1 79,15.5 v78.5,15
  Bottom 0.254: v69,18 69,17 70.5,15.5 76.5,15.5 77.75,14.25 | 77.75,14.25 78.5,13.5 78.5,8 v79,7.5 | v78.5,15 77.75,14.25
THERMISTOR-EN  (via drill 0.3 pad 0.25)
  Top 0.254: v48.5,13 49.62,13 IC1.1 | Q2.1 64.4,49.9 60,45.5 v60,25.5
  Bottom 0.254: v60,25.5 60,21.5 51.5,13 v48.5,13
TXD  (via drill 0.3)
  Top 0.254: IC1.47 47,15.25 42.75,11 v41,11 | v37.5,11 37,11 34.75,8.75 R14.1
  Bottom 0.254: v41,11 v37.5,11

### Text on the board
_tsilk: SmartThermometer | Rev 2